# EAGLE schematic FeatherWing_Blank (EAGLE 9.4.2)
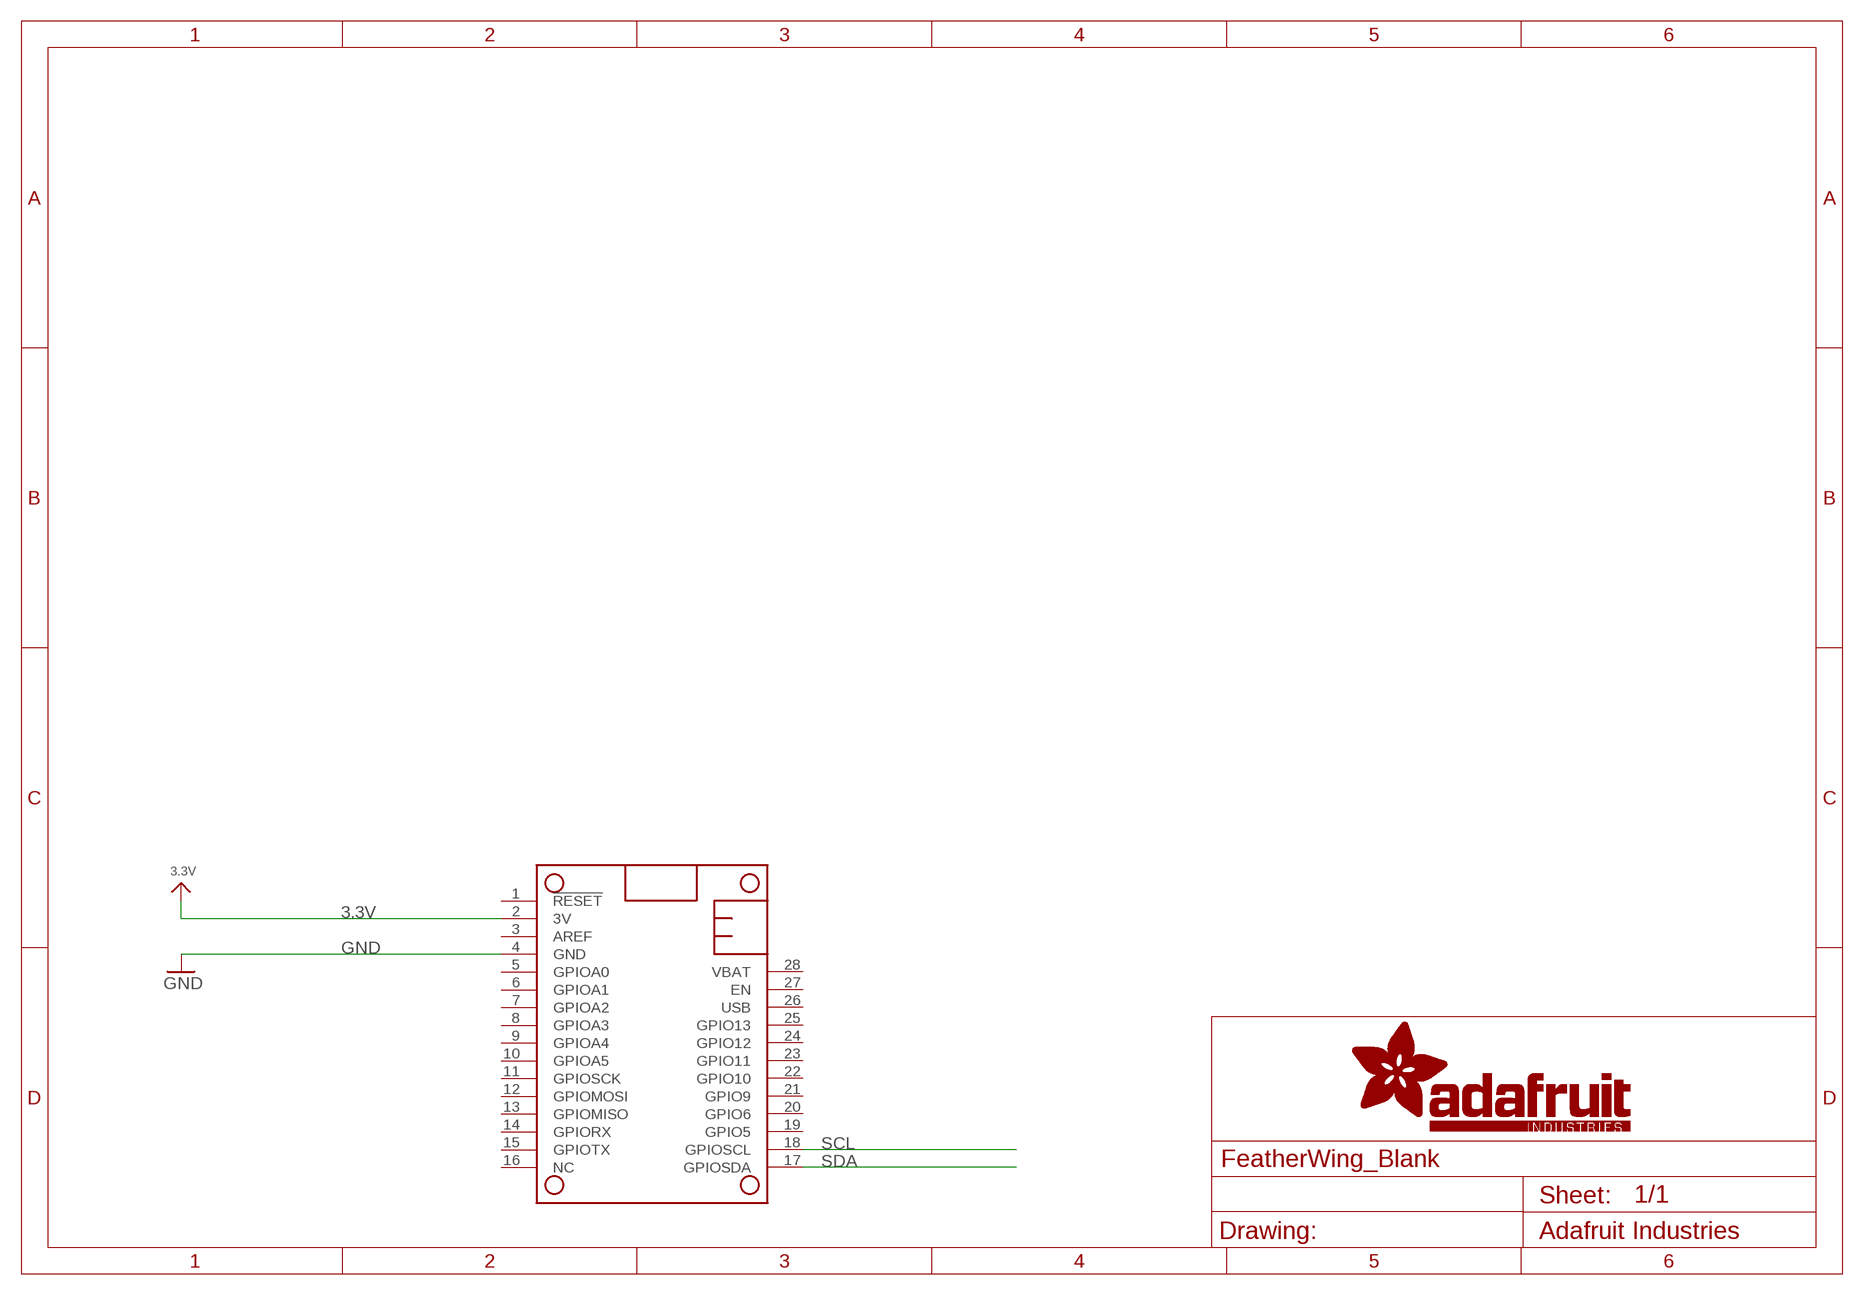
[diagram p0: schematic, sheet 1]

## Parts
MS1  FEATHERWING  [FEATHERWING]

## Nets
3.3V: MS1.2(3V)
GND: MS1.4(GND)
SCL: MS1.18(GPIOSCL)
SDA: MS1.17(GPIOSDA)
Unconnected: MS1.1(!RESET) MS1.3(AREF) MS1.5(GPIOA0) MS1.6(GPIOA1) MS1.7(GPIOA2) MS1.8(GPIOA3) MS1.9(GPIOA4) MS1.10(GPIOA5) MS1.11(GPIOSCK) MS1.12(GPIOMOSI) MS1.13(GPIOMISO) MS1.14(GPIORX) MS1.15(GPIOTX) MS1.16(NC) MS1.19(GPIO5) MS1.20(GPIO6) MS1.21(GPIO9) MS1.22(GPIO10) MS1.23(GPIO11) MS1.24(GPIO12) MS1.25(GPIO13) MS1.26(USB) MS1.27(EN) MS1.28(VBAT)

## Library data of the parts
MS1 = microbuilder:FEATHERWING